# Altium project 计算机原理实验5.PrjPCB
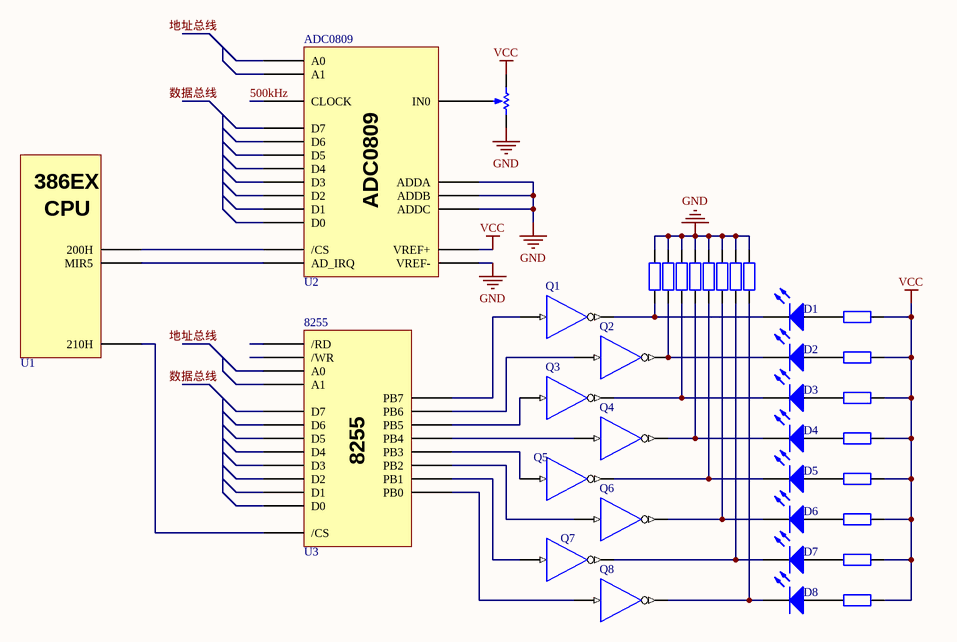
[diagram p0: 计算机原理实验5.SchDoc]
1 sheet, 36 parts. Net scope: global (net labels, ports and power ports of the same name join across sheets).

## Sheet 计算机原理实验5.SchDoc
size A4

### Parts
8255  U3
?  U1
ADC0809  U2
D1  LED0  [LED-0]  (value not drawn)
D2  LED0  [LED-0]  (value not drawn)
D3  LED0  [LED-0]  (value not drawn)
D4  LED0  [LED-0]  (value not drawn)
D5  LED0  [LED-0]  (value not drawn)
D6  LED0  [LED-0]  (value not drawn)
D7  LED0  [LED-0]  (value not drawn)
D8  LED0  [LED-0]  (value not drawn)
Q1  NOT  (value not drawn)
Q2  NOT  (value not drawn)
Q3  NOT  (value not drawn)
Q4  NOT  (value not drawn)
Q5  NOT  (value not drawn)
Q6  NOT  (value not drawn)
Q7  NOT  (value not drawn)
Q8  NOT  (value not drawn)
R1  Res2  [AXIAL-0.4]  (value not drawn)
R2  Res2  [AXIAL-0.4]  (value not drawn)
R3  Res2  [AXIAL-0.4]  (value not drawn)
R4  Res2  [AXIAL-0.4]  (value not drawn)
R5  Res2  [AXIAL-0.4]  (value not drawn)
R6  Res2  [AXIAL-0.4]  (value not drawn)
R7  Res2  [AXIAL-0.4]  (value not drawn)
R8  Res2  [AXIAL-0.4]  (value not drawn)
R9  Res2  [AXIAL-0.4]  (value not drawn)
R10  Res2  [AXIAL-0.4]  (value not drawn)
R11  Res2  [AXIAL-0.4]  (value not drawn)
R12  Res2  [AXIAL-0.4]  (value not drawn)
R13  Res2  [AXIAL-0.4]  (value not drawn)
R14  Res2  [AXIAL-0.4]  (value not drawn)
R15  Res2  [AXIAL-0.4]  (value not drawn)
R17  Res2  [AXIAL-0.4]  (value not drawn)
R?  RPot  [VR5]  (value not drawn)

### Nets
GND: ADC0809.GND(ADDA) R1.2 R2.2 R3.2 R4.2 R5.2 R6.2 R7.2 R8.2 R?.2(BOT)
VCC: ADC0809.GND(VREF+) R9.1 R10.1 R11.1 R12.1 R13.1 R14.1 R15.1 R17.1 R?.1(TOP)
500kHz: ADC0809.GND(A0)
Net8255_GND: 8255.GND(/CS) ?.GND(210H)
Net8255_GND: 8255.GND(/RD) Q6.1(A)  [a separate net that carries the same name]
Net8255_GND: 8255.GND(PB1) Q7.1(A)  [a separate net that carries the same name]
Net8255_GND: 8255.GND(PB0) Q8.1(A)  [a separate net that carries the same name]
Net8255_GND: 8255.GND(PB7) Q1.1(A)  [a separate net that carries the same name]
Net8255_GND: 8255.GND(PB6) Q2.1(A)  [a separate net that carries the same name]
Net8255_GND: 8255.GND(PB5) Q3.1(A)  [a separate net that carries the same name]
Net8255_GND: 8255.GND(PB4) Q4.1(A)  [a separate net that carries the same name]
Net8255_GND: 8255.GND(PB3) Q5.1(A)  [a separate net that carries the same name]
Net?_GND: ?.GND(200H) ADC0809.GND(/CS)
Net?_GND: ?.GND(MIR5) ADC0809.GND(AD_IRQ)  [a separate net that carries the same name]
NetADC0809_GND: ADC0809.GND(IN0) R?.3(TAP)
NetD1_1: D1.1(A) R9.2
NetD1_2: D1.2(K) Q1.2(Y) R1.1
NetD2_1: D2.1(A) R10.2
NetD2_2: D2.2(K) Q2.2(Y) R2.1
NetD3_1: D3.1(A) R11.2
NetD3_2: D3.2(K) Q3.2(Y) R3.1
NetD4_1: D4.1(A) R12.2
NetD4_2: D4.2(K) Q4.2(Y) R4.1
NetD5_1: D5.1(A) R13.2
NetD5_2: D5.2(K) Q5.2(Y) R5.1
NetD6_1: D6.1(A) R14.2
NetD6_2: D6.2(K) Q6.2(Y) R6.1
NetD7_1: D7.1(A) R15.2
NetD7_2: D7.2(K) Q7.2(Y) R7.1
NetD8_1: D8.1(A) R17.2
NetD8_2: D8.2(K) Q8.2(Y) R8.1

### Notes on the sheet
- Labels drawn without touching a wire or pin: 地址总线, 数据总线
- (in symbol 386EX) CPU

### Library data of the parts
8255 = 8255
? = 386EX
ADC0809 = ADC0809
D1-D8 = LED0: Typical INFRARED GaAs LED; Published: 8-Jun-2000; LatestRevisionDate: 08-Jul-2005; LatestRevisionNote: Mech Layer 1 removed.; PackageReference: LED-0; Publisher: Altium Limited; PackageDescription: LED; 2 Leads
Q1-Q8 = NOT: Inverter
R1-R15 R17 = Res2: Resistor; Value: 1K; Published: 8-Jun-2000; LatestRevisionDate: 17-Jul-2002; LatestRevisionNote: Re-released for DXP Platform.; PackageReference: AXIAL-0.4; Publisher: Altium Limited; PackageDescription: Axial Device, Thru-Hole; 2 Leads; 0.4 in Pin Spacing
R? = RPot: Potentiometer; Sim Note: Enter the Resistance value and the set point into parameter fields.; Set Position: 0.5; Value: 1K; Published: 8-Jun-2000; LatestRevisionDate: 17-Jul-2002; LatestRevisionNote: Re-released for DXP Platform.; PackageReference: VR5; Publisher: Altium Limited; PackageDescription: Variable Resistor, Thru-Hole; 3 Leads